# EAGLE design AVC-LAN-2 (EAGLE 6.1)
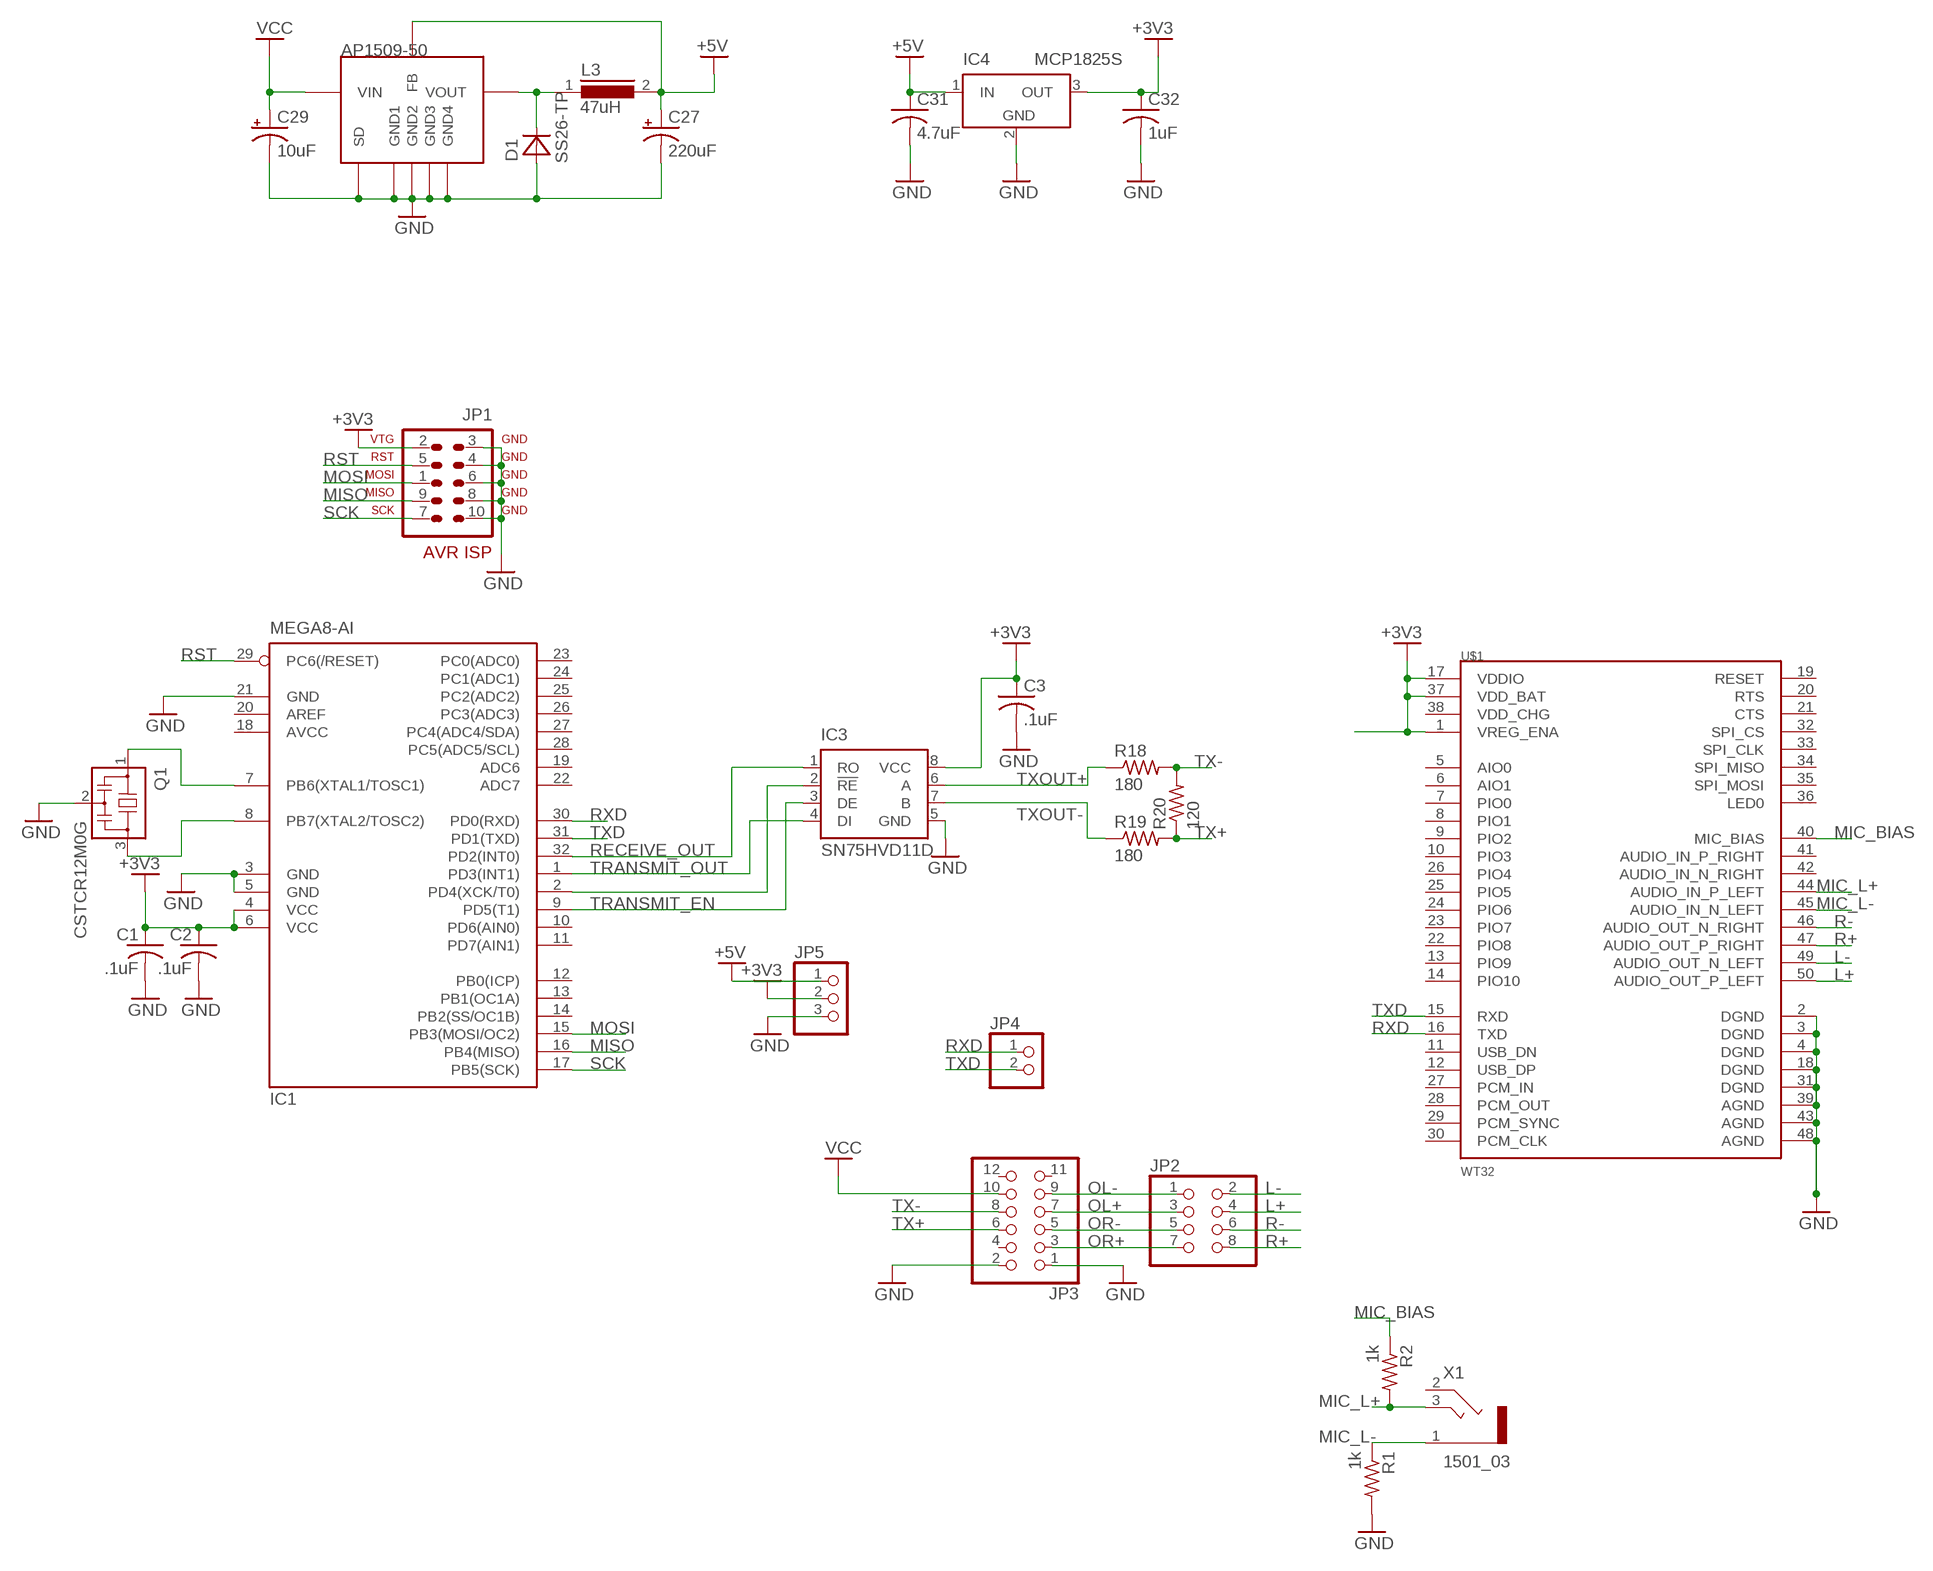
[diagram p0: schematic, sheet 1]

## Parts
C1  .1uF  C-USC0603  [C0603]
C2  .1uF  C-USC0603  [C0603]
C3  .1uF  C-USC0603  [C0603]
C27  220uF  CPOL-USD/7343-31W  [D/7343-31W]
C29  10uF  CPOL-USC/6032-28R  [C/6032-28R]
C31  4.7uF  C-USC0603  [C0603]
C32  1uF  C-USC0603  [C0603]
D1  SS26-TP  MBRA340T3  [SMA]
IC1  MEGA8-AI  [TQFP32-08]
IC3  SN75HVD11D  LTC485S  [SOIC8]
IC4  MCP1825S  LT1963EST-3.3  [SOT223]
JP1  AVR-ISP-10R  [AVR-ISP-10R]
JP2  PINHD-2X4  [2X04]
JP3  PINHD-2X6/90  [2X06/90]
JP4  PINHD-1X2  [1X02]
JP5  PINHD-1X3  [1X03]
L3  47uH  DR125  [DR125]
Q1  CSTCR12M0G  CSTCR6M00G53Z  [CSTER12M]
R1  1k  R-US_R0603  [R0603]
R2  1k  R-US_R0603  [R0603]
R18  180  R-US_R0603  [R0603]
R19  180  R-US_R0603  [R0603]
R20  120  R-US_R0603  [R0603]
U$1  WT32  [WT32]
U$5  AP1509-50  [SOP-8L]
X1  1501_03  [1501_03]

## Nets
+3V3: C1.1 C2.1 C3.1 C32.1 IC1.4(VCC) IC1.6(VCC) IC3.8(VCC) IC4.3(OUT) JP1.2 JP5.2 U$1.1(VREG_ENA) U$1.17(VDDIO) U$1.37(VDD_BAT)
+5V: C27.+ C31.1 IC4.1(IN) JP5.1 L3.2 U$5.P$3(FB)
GND: C1.2 C2.2 C3.2 C27.- C29.- C31.2 C32.2 D1.A IC1.3(GND) IC1.5(GND) IC1.21(GND) IC3.5(GND) IC4.2(GND) JP1.3 JP1.4 JP1.6 JP1.8 JP1.10 JP3.1 JP3.2 JP5.3 Q1.2 R1.2 U$1.2(DGND) U$1.3(DGND) U$1.4(DGND) U$1.18(DGND) U$1.31(DGND) U$1.39(AGND) U$1.43(AGND) U$1.48(AGND) U$5.P$4(SD) U$5.P$5(GND1) U$5.P$6(GND2) U$5.P$7(GND3) U$5.P$8(GND4)
L+: JP2.4 U$1.50(AUDIO_OUT_P_LEFT)
L-: JP2.2 U$1.49(AUDIO_OUT_N_LEFT)
MIC_BIAS: R2.1 U$1.40(MIC_BIAS)
MIC_L+: R2.2 U$1.44(AUDIO_IN_P_LEFT) X1.3
MIC_L-: R1.1 U$1.45(AUDIO_IN_N_LEFT) X1.1
MISO: IC1.16(PB4(MISO)) JP1.9
MOSI: IC1.15(PB3(MOSI/OC2)) JP1.1
N$1: IC1.2(PD4(XCK/T0)) IC3.2(!RE)
N$23: IC1.7(PB6(XTAL1/TOSC1)) Q1.1
N$24: IC1.8(PB7(XTAL2/TOSC2)) Q1.3
OL+: JP2.3 JP3.7
OL-: JP2.1 JP3.9
OR+: JP2.7 JP3.3
OR-: JP2.5 JP3.5
R+: JP2.8 U$1.47(AUDIO_OUT_P_RIGHT)
R-: JP2.6 U$1.46(AUDIO_OUT_N_RIGHT)
RECEIVE_OUT: IC1.32(PD2(INT0)) IC3.1(RO)
RST: IC1.29(PC6(/RESET)) JP1.5
RXD: IC1.30(PD0(RXD)) JP4.1 U$1.16(TXD)
SCK: IC1.17(PB5(SCK)) JP1.7
TRANSMIT_EN: IC1.9(PD5(T1)) IC3.3(DE)
TRANSMIT_OUT: IC1.1(PD3(INT1)) IC3.4(DI)
TX+: JP3.6 R19.2 R20.1
TX-: JP3.8 R18.2 R20.2
TXD: IC1.31(PD1(TXD)) JP4.2 U$1.15(RXD)
TXOUT+: IC3.6(A) R18.1
TXOUT-: IC3.7(B) R19.1
VCC: C29.+ JP3.10 U$5.P$1(VIN)
VOUT: D1.C L3.1 U$5.P$2(VOUT)
Unconnected: IC1.10(PD6(AIN0)) IC1.11(PD7(AIN1)) IC1.12(PB0(ICP)) IC1.13(PB1(OC1A)) IC1.14(PB2(SS/OC1B)) IC1.19(ADC6) IC1.20(AREF) IC1.22(ADC7) IC1.23(PC0(ADC0)) IC1.24(PC1(ADC1)) IC1.25(PC2(ADC2)) IC1.26(PC3(ADC3)) IC1.27(PC4(ADC4/SDA)) IC1.28(PC5(ADC5/SCL)) JP3.4 JP3.11 JP3.12 U$1.5(AIO0) U$1.6(AIO1) U$1.7(PIO0) U$1.8(PIO1) U$1.9(PIO2) U$1.10(PIO3) U$1.11(USB_DN) U$1.12(USB_DP) U$1.13(PIO9) U$1.14(PIO10) U$1.19(RESET) U$1.20(RTS) U$1.21(CTS) U$1.22(PIO8) U$1.23(PIO7) U$1.24(PIO6) U$1.25(PIO5) U$1.26(PIO4) U$1.27(PCM_IN) U$1.28(PCM_OUT) U$1.29(PCM_SYNC) U$1.30(PCM_CLK) U$1.32(SPI_CS) U$1.33(SPI_CLK) U$1.34(SPI_MISO) U$1.35(SPI_MOSI) U$1.36(LED0) U$1.38(VDD_CHG) U$1.41(AUDIO_IN_P_RIGHT) U$1.42(AUDIO_IN_N_RIGHT) X1.2

## Power pins joined to a net without a drawn wire
AVCC: IC1.18(AVCC)
GND: IC4.4(GND)

## Library data of the parts
C1-C3 C31 C32 = rcl-2:C-US: CAPACITOR, American symbol
C27 C29 = rcl:CPOL-US: POLARIZED CAPACITOR, American symbol
D1 = diode:MBRA340T3: Surface Mount Schottky Power Rectifier Source: http://www.onsemi.com/pub_link/Collateral/MBRA340T3-D.PDF
IC1 = atmel:MEGA8: MICROCONTROLLER 8 Kbytes FLASH, 1 kbytes SRAM, 512 bytes EEPROM, USART, 6-channel 10 bit ADC, 2-channel 8 bit ADC Pin compatible with Atmega48, ATMega88, ATMega168 Source: avr.lbr; MPN: ATMEGA8-16AU; OC_FARNELL: 9171371; OC_NEWARK: 73M8863
IC3 = linear-technology:LTC485: Low Power RS485 Interface Transceiver Source: http://www.linear.com/pc/downloadDocument.do?navId=H0,C1,C1007,C1017,P2064,D1718; OC_FARNELL: unknown; OC_NEWARK: unknown
IC4 = linear-technology:LT1963EST: 1.5A, Low Noise, Fast Transient Response LDO Regulator Source: http://www.linear.com/pc/downloadDocument.do?navId=H0,C3,P2222,D3148; MPN: LT1963EST-3.3; OC_FARNELL: 1501032; OC_NEWARK: 57M7546
JP1 = avr-7:AVR-ISP-10: AVR ISP-10 Serial Programming Header
JP2 = pinhead:PINHD-2X4: PIN HEADER
JP3 = pinhead:PINHD-2X6: PIN HEADER
JP4 = pinhead:PINHD-1X2: PIN HEADER
JP5 = pinhead:PINHD-1X3: PIN HEADER
L3 = inductors:DR125: High Power Density, High Efficiency, Shielded Inductors Source: coiltronics_dr_series.pdf
Q1 = cstce-resonator:CSTCR: Resonator Source: murata.co.jp; MPN: CSTCC12M0; OC_FARNELL: 1170434; OC_NEWARK: 25M8759
R1 R2 R18-R20 = rcl-2:R-US_: RESISTOR, American symbol
U$1 = SparkFun:WT32: Blue Giga Audio Bluetooth Module Footprint is not confirmed yet.
U$5 = buckReg:AP1509-50
X1 = con-lumberg-mod:1501_03: Klinkensteckverbinder nach JISC 6560, 3,5 mm Jack connectors according to JISC 6560, 2.5 mm Source: http://www.lumberg.com/Produkte/PDFs/1501_03.pdf; OC_FARNELL: 1200127; OC_NEWARK: unknown

## Board
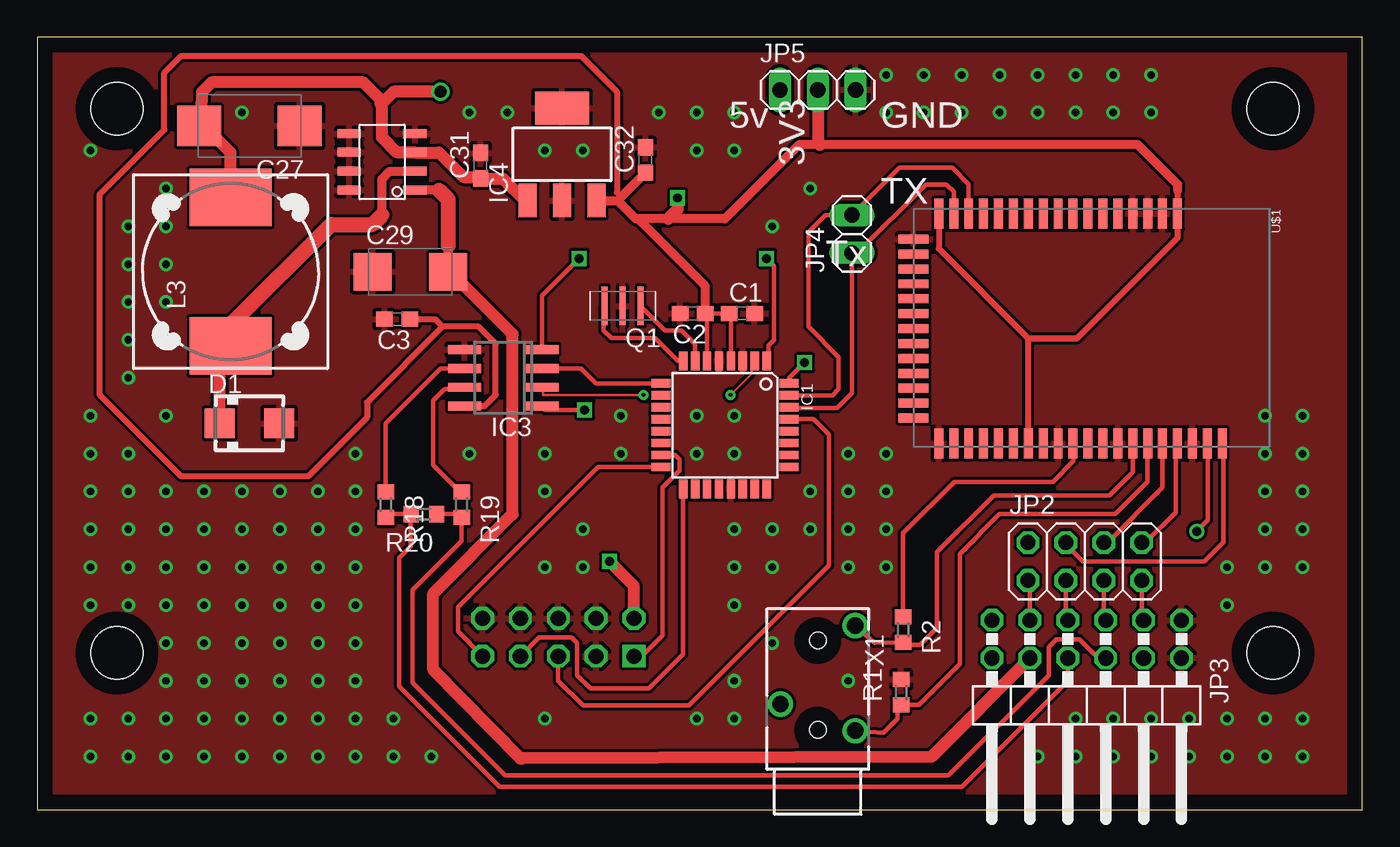
[diagram p1: board, top side]
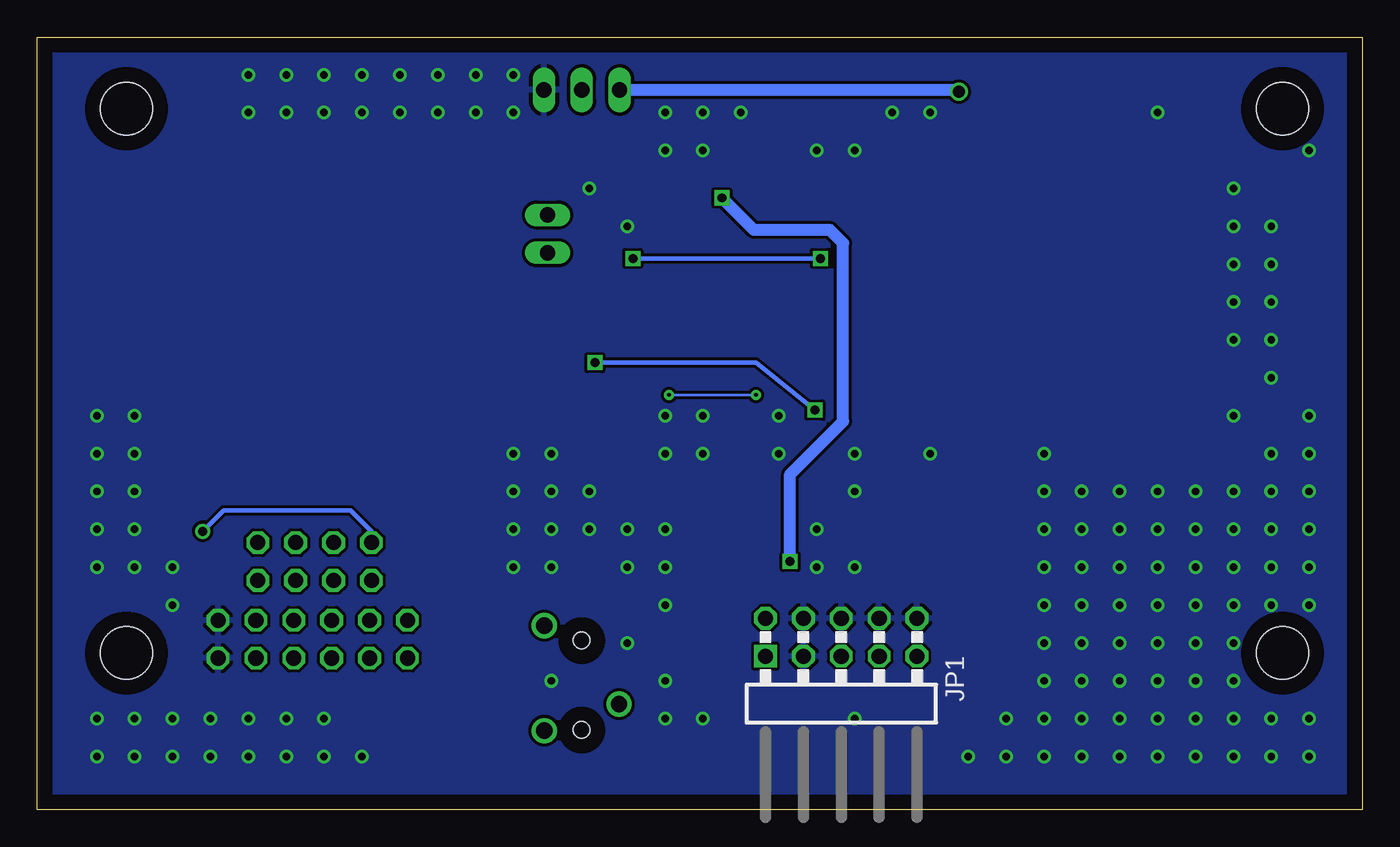
[diagram p2: board, bottom side, seen from below]

Size 88.82 x 51.79 mm. Coordinates in mm from the lower left corner, seen from the top.
Outline: 0,0 88.82,0 88.82,51.79 0,51.79 0,0
Copper layers (1*16): Top 0.035mm / dielectric 1.5mm / Bottom 0.035mm
Design rules: minimum track width 7mil, minimum drill 10mil, track to track 8mil, track to pad 8mil, pad to pad 7mil, via to via 8mil, smd to smd 7mil, copper to edge 40mil, drill to drill 8mil, minimum pad ring 10mil, minimum via ring 8mil, stop-mask expansion 4mil, vias tented up to drill 0mil, thermal gap 10mil
Holes 3.51 mm at 5.35,10.5 82.84,10.5 82.84,47 5.35,47

### Footprints (pad centres in the part's own frame; a part is rotated, then mirrored left to right if it is on the bottom)
C0603 = smd 1.1 x 1: 1 -0.85,0; 2 0.85,0
D/7343-31W = smd 2.95 x 2.7: + 3.375,0; - -3.375,0
C/6032-28R = smd 2.55 x 2.5: + 2.525,0; - -2.525,0
SMA = smd 2 x 2: A 2,0; C -2,0
TQFP32-08 = smd 1.27 x 0.559: 1 -4.293,2.8; 2 -4.293,2; 3 -4.293,1.2; 4 -4.293,0.4; 5 -4.293,-0.4; 6 -4.293,-1.2; 7 -4.293,-2; 8 -4.293,-2.8; 17 4.293,-2.8; 18 4.293,-2; 19 4.293,-1.2; 20 4.293,-0.4; 21 4.293,0.4; 22 4.293,1.2; 23 4.293,2; 24 4.293,2.8 | smd 0.559 x 1.27: 9 -2.8,-4.293; 10 -2,-4.293; 11 -1.2,-4.293; 12 -0.4,-4.293; 13 0.4,-4.293; 14 1.2,-4.293; 15 2,-4.293; 16 2.8,-4.293; 25 2.8,4.293; 26 2,4.293; 27 1.2,4.293; 28 0.4,4.293; 29 -0.4,4.293; 30 -1.2,4.293; 31 -2,4.293; 32 -2.8,4.293
SOIC8 = smd 0.6 x 2.2: 1 -1.905,-2.6; 2 -0.635,-2.6; 3 0.635,-2.6; 4 1.905,-2.6; 5 1.905,2.6; 6 0.635,2.6; 7 -0.635,2.6; 8 -1.905,2.6
SOT223 = smd 1.219 x 2.235: 1 -2.311,-3.099; 2 0,-3.099; 3 2.311,-3.099 | smd 3.6 x 2.2: 4 0,3.099
AVR-ISP-10R = drill 1.016 square: 1 -5.08,-1.27 | drill 1.016 octagon: 2 -5.08,1.27; 3 -2.54,-1.27; 4 -2.54,1.27; 5 0,-1.27; 6 0,1.27; 7 2.54,-1.27; 8 2.54,1.27; 10 5.08,1.27 | drill 1.016 pad 1.422 octagon: 9 5.08,-1.27
2X04 = drill 1.016 octagon: 1 -3.81,-1.27; 2 -3.81,1.27; 3 -1.27,-1.27; 4 -1.27,1.27; 5 1.27,-1.27; 6 1.27,1.27; 7 3.81,-1.27; 8 3.81,1.27
2X06/90 = drill 1.016 octagon: 1 -6.35,-6.35; 2 -6.35,-3.81; 3 -3.81,-6.35; 4 -3.81,-3.81; 5 -1.27,-6.35; 6 -1.27,-3.81; 7 1.27,-6.35; 8 1.27,-3.81; 9 3.81,-6.35; 10 3.81,-3.81; 11 6.35,-6.35; 12 6.35,-3.81
1X02 = drill 1.016 long: 1 -1.27,0; 2 1.27,0
1X03 = drill 1.016 long: 1 -2.54,0; 2 0,0; 3 2.54,0
DR125 = smd 3.85 x 5.5: 1 -4.975,0; 2 4.975,0
CSTER12M = smd 0.4 x 2.6: 1 -1.2,0; 2 0,0; 3 1.2,0
R0603 = smd 1 x 1.1: 1 -0.85,0; 2 0.85,0
WT32 = smd 2 x 0.6: 1 -7.7,5.7; 2 -7.7,4.7; 3 -7.7,3.7; 4 -7.7,2.7; 5 -7.7,1.7; 6 -7.7,0.7; 7 -7.7,-0.3; 8 -7.7,-1.3; 9 -7.7,-2.3; 10 -7.7,-3.3; 11 -7.7,-4.3; 12 -7.7,-5.3; 13 -7.7,-6.3; 14 -7.7,-7.3; 15 -7.7,-8.3; 16 -7.7,-9.3; 17 -7.7,-10.3; 31 7.7,-10.3; 32 7.7,-9.3; 33 7.7,-8.3; 34 7.7,-7.3; 35 7.7,-6.3; 36 7.7,-5.3; 37 7.7,-4.3; 38 7.7,-3.3; 39 7.7,-2.3; 40 7.7,-1.3; 41 7.7,-0.3; 42 7.7,0.7; 43 7.7,1.7; 44 7.7,2.7; 45 7.7,3.7; 46 7.7,4.7; 47 7.7,5.7; 48 7.7,6.7; 49 7.7,7.7; 50 7.7,8.7 | smd 0.6 x 2: 18 -6,-12; 19 -5,-12; 20 -4,-12; 21 -3,-12; 22 -2,-12; 23 -1,-12; 24 0,-12; 25 1,-12; 26 2,-12; 27 3,-12; 28 4,-12; 29 5,-12; 30 6,-12
SOP-8L = smd 0.6 x 1.55: P$1 -1.905,-2.2; P$2 -0.635,-2.2; P$3 0.635,-2.2; P$4 1.905,-2.2; P$5 1.905,2.2; P$6 0.655,2.2; P$7 -0.635,2.2; P$8 -1.905,2.2
1501_03 = drill 1.1 pad 1.7: 1 -2.5,0.3; 2 2.5,-1.5; 3 -2.5,-6.75 | hole 1.1: 0,0.25; 0,-5.75

### Placement (x,y rotation side)
C1  47.24,33.27 0 top
C2  43.94,33.27 180 top
C3  24.13,32.89 180 top
C27  14.22,45.85 180 top
C29  25.02,36.07 0 top
C31  29.72,43.18 90 top
C32  40.77,43.56 90 top
D1  14.22,25.91 0 top
IC1  46.1,25.78 270 top
IC3  31.24,28.96 90 top
IC4  35.18,43.94 0 top
JP1  34.92,11.56 0 bottom
JP2  70.23,16.64 0 top
JP3  70.36,6.35 180 top
JP4  54.61,38.61 90 top
JP5  52.32,48.26 0 top
L3  12.95,36.07 90 top
Q1  39.24,33.78 180 top
R1  57.91,7.87 90 top
R2  58.04,12.06 270 top
R18  23.37,20.45 270 top
R19  28.45,20.45 270 top
R20  25.91,19.81 180 top
U$1  70.74,32.26 270 top
U$5  23.11,43.43 90 top
X1  52.32,5.59 180 top

### Tracks (layer width: path | path; a pad name or v marks a point on that pad's centre or on a via)
+3V3  (via drill 0.6)
  Top 0.305: IC1.4 46.5,33.17 C1.1 C2.1 44.9,33.16 IC1.6
  Top 0.406: U$1.17 60.44,37.6 66.42,31.62 | 66.42,31.62 66.44,31.61 | U$1.37 66.44,31.61 | 66.44,31.61 69.7,31.61 69.72,31.62 | 76.45,39.94 76.45,38.35 69.72,31.62 | 76.45,39.94 U$1.1 | 66.42,31.62 69.72,31.62 | 76.45,39.94 76.45,41.53 | IC3.8 29.97,27.05 30.73,27.81 30.73,31.24 29.59,32.38 27.18,32.38 | 27.18,32.38 22.1,27.3 22.1,26.29 18.16,22.35 9.65,22.35 4.19,27.81 4.19,41.27 8.51,45.59 8.51,49.4 9.65,50.55 36.45,50.55 38.86,48.13 38.86,41.4 39.16,41.1 | C3.1 26.67,32.89 27.18,32.38
  Top 0.61: IC4.3 38.9,40.84 | 38.9,40.84 39.16,41.1 C32.1 | 76.45,41.53 76.45,41.91 73.79,44.58 52.45,44.58 51.05,44.58 46.1,39.62 42.29,39.62 40.26,39.62 | 40.26,39.62 40.12,39.62 38.9,40.84 | C2.1 44.79,35.09 40.26,39.62
  Top 0.813: JP1.2 40,14.99 v38.35,16.64 | v42.93,41.02 42.93,40.26 42.29,39.62 | JP5.2 52.32,44.7 52.45,44.58
  Bottom 0.813: v38.35,16.64 38.35,22.48 34.8,26.04 34.8,37.97 35.69,38.86 40.77,38.86 v42.93,41.02
+5V  (via drill 0.8)
  Top 0.178: 11.3,45.72 11.18,45.59 C27.+
  Top 0.813: L3.2 12.95,44.07 11.3,45.72 10.79,46.23 | IC4.1 32.69,40.84 31.24,42.29 29.76,42.29 C31.1 29.63,42.42 28.57,42.42 26.92,44.07 U$5.P$3 24.13,44.07 23.11,45.09 23.11,47.37 | 23.11,47.37 23.11,47.5 | 23.11,47.5 21.84,48.77 11.68,48.77 11.05,48.13 10.92,46.3 C27.+ | v27.05,48.13 23.88,48.13 23.11,47.37 | 23.11,47.37 22.99,47.37 23.11,47.5
  Bottom 0.813: JP5.1 27.18,48.26 v27.05,48.13
GND  (via drill 0.5)
  other vias: 3.56,3.56 6.1,3.56 8.64,3.56 11.18,3.56 13.72,3.56 16.26,3.56 18.8,3.56 21.34,3.56 23.88,3.56 26.42,3.56 23.88,6.1 21.34,6.1 18.8,6.1 16.26,6.1 13.72,6.1 11.18,6.1 8.64,6.1 3.56,6.1 6.1,6.1 8.64,8.64 11.18,8.64 13.72,8.64 16.26,8.64 18.8,8.64 21.34,8.64 21.34,11.18 21.34,13.72 18.8,13.72 18.8,11.18 16.26,11.18 13.72,11.18 11.18,11.18 8.64,11.18 8.64,13.72 8.64,16.26 6.1,16.26 6.1,13.72 3.56,13.72 3.56,16.26 11.18,16.26 11.18,13.72 13.72,13.72 13.72,18.8 13.72,16.26 16.26,16.26 16.26,13.72 18.8,16.26 21.34,16.26 21.34,18.8 21.34,21.34 21.34,23.88 18.8,21.34 18.8,18.8 16.26,21.34 16.26,18.8 11.18,18.8 8.64,18.8 6.1,18.8 3.56,18.8 3.56,21.34 6.1,21.34 8.64,21.34 11.18,21.34 13.72,21.34 3.56,23.88 3.56,26.42 6.1,23.88 8.64,26.42 28.96,23.88 34.04,23.88 34.04,21.34 34.04,16.26 36.58,18.8 36.58,16.26 39.12,23.88 39.12,26.42 44.2,26.42 44.2,23.88 46.74,23.88 46.74,26.42 49.28,18.8 51.82,18.8 51.82,21.34 46.74,18.8 46.74,16.26 46.74,13.72 49.28,16.26 54.36,18.8 54.36,21.34 54.36,23.88 56.9,16.26 56.9,23.88 56.9,21.34 56.9,18.8 54.36,16.26 46.74,8.64 49.28,11.18 44.2,6.1 46.74,6.1 34.04,6.1 54.36,8.64 69.6,6.1 67.06,3.56 69.6,3.56 72.14,3.56 72.14,6.1 74.68,6.1 77.22,6.1 74.68,3.56 77.22,3.56 79.76,3.56 82.3,3.56 84.84,3.56 79.76,6.1 82.3,6.1 84.84,6.1 79.76,16.26 79.76,13.72 82.3,16.26 84.84,16.26 84.84,18.8 84.84,23.88 84.84,21.34 82.3,21.34 82.3,18.8 82.3,23.88 82.3,26.42 84.84,26.42 6.1,28.96 8.64,31.5 6.1,34.04 8.64,36.58 6.1,31.5 8.64,34.04 6.1,36.58 6.1,39.12 8.64,41.66 8.64,39.12 3.56,44.2 13.72,46.74 28.96,46.74 31.5,46.74 34.04,44.2 36.58,44.2 41.66,46.74 44.2,46.74 46.74,46.74 46.74,44.2 44.2,44.2 49.28,39.12 51.82,41.66 56.9,46.74 56.9,49.28 59.44,49.28 61.98,49.28 64.52,49.28 67.06,49.28 69.6,49.28 72.14,49.28 74.68,49.28 74.68,46.74 72.14,46.74 69.6,46.74 67.06,46.74 64.52,46.74 61.98,46.74 59.44,46.74
  pour Bottom: 0.64,0.64 0.64,51.44 88.27,51.44 88.27,0.64
  pour Top: 0.64,0.64 0.64,51.44 88.27,51.44 88.27,0.64
L+
  Top 0.305: JP2.4 68.96,17.78 70.1,16.64 78.23,16.64 79.5,17.91 79.5,24.5 U$1.50
L-  (via drill 0.6)
  Top 0.305: v77.72,18.67 78.49,19.43 78.49,24.51 U$1.49
  Bottom 0.305: JP2.2 66.42,18.67 67.82,20.07 76.33,20.07 v77.72,18.67
MIC_BIAS
  Top 0.305: R2.1 58.04,18.54 61.47,21.97 68.07,21.97 69.47,23.37 69.47,24.02 U$1.40
MIC_L+
  Top 0.305: X1.3 56.11,11.2 R2.2 58.08,11.05 59.18,11.05 60.32,12.19 60.32,17.27 64.14,21.08 71.88,21.08 73.44,22.64 U$1.44
MIC_L-
  Top 0.305: X1.1 56.72,5.16 57.66,6.1 57.66,6.6 58.04,6.99 | 57.91,6.99 58.04,6.99 | R1.1 58,7.02 | 58,7.02 58.04,6.99 | 58,7.02 59.09,7.02 61.85,9.78 61.85,17.14 64.52,19.81 72.26,19.81 74.42,21.97 74.42,24.67 U$1.45
MISO
  Top 0.305: IC1.16 37.59,22.98 28.19,13.59 28.19,11.94 JP1.9
MOSI
  Top 0.305: JP1.1 40.51,10.29 41.91,11.68 41.91,21.59 43.05,22.73 43.05,23.5 42.77,23.78 IC1.15
N$1  (via drill 0.25)
  Top 0.178: v46.48,27.81 47.88,29.21 47.88,29.84 48.01,29.97 IC1.2 | v40.64,27.81 33.91,27.81 33.91,28.32 IC3.2
  Bottom 0.178: v40.64,27.81 v46.48,27.81
N$23
  Top 0.305: IC1.7 44.1,31.21 43.18,32.13 42.09,32.13 Q1.1
N$24
  Top 0.305: IC1.8 42.95,30.07 41.4,31.62 38.48,31.62 37.97,32.13 37.97,33.71 Q1.3
OL+
  Top 0.305: JP2.3 68.96,12.83 JP3.7
OL-
  Top 0.305: JP3.9 66.55,15.49 66.42,15.49 JP2.1
OR+
  Top 0.305: JP2.7 74.04,12.83 JP3.3
OR-
  Top 0.305: JP2.5 71.5,12.83 JP3.5
R+
  Top 0.305: JP2.8 74.3,17.91 76.33,19.94 76.33,24.45 U$1.47
R-
  Top 0.305: JP2.6 71.75,17.91 75.44,21.59 U$1.46
RECEIVE_OUT  (via drill 0.6)
  Top 0.178: IC3.1 33.91,27.05 33.85,26.99
  Top 0.305: IC1.32 50.39,28.93 v51.44,29.97 | v36.7,26.8 34.04,26.8 33.85,26.99 33.78,27.05
  Bottom 0.305: v51.44,29.97 40.64,29.97 v36.7,26.8
RST
  Top 0.305: IC1.29 52.05,26.18 53.09,25.15 53.09,16.38 43.69,6.99 36.58,6.99 34.92,8.64 JP1.5
RXD
  Top 0.305: U$1.16 61.44,41.43 60.96,41.91 59.56,41.91 54.99,37.34 JP4.1 54.61,27.94 53.59,26.92 50.45,26.92 IC1.30
SCK
  Top 0.305: IC1.17 43.3,10.41 41.02,8.13 37.08,8.13 36.2,9.02 36.2,11.18 35.81,11.56 33.66,11.56 JP1.7
TRANSMIT_EN
  Top 0.305: IC1.9 37.46,28.58 36.45,29.59 IC3.3
TRANSMIT_OUT  (via drill 0.6)
  Top 0.178: IC1.1 48.89,30.1 49.02,30.1
  Top 0.305: IC3.4 33.84,34.48 v36.32,36.96 | v48.89,36.96 49.4,36.45 49.4,31.5 49.02,31.11 49.02,30.1 48.89,29.97
  Bottom 0.305: v36.32,36.96 v48.89,36.96
TX+
  Top 0.305: R20.1 28.23,19.81 R19.2 28.45,18.03 25.15,14.73 25.15,8.51 31.37,2.29 61.09,2.29 67.82,9.02 67.82,10.92 68.33,11.43 69.85,11.43 70.87,10.41 71.5,10.41 71.75,10.16 JP3.6
TX-
  Top 0.305: R20.2 25.02,19.81 | 25.02,19.81 23.58,19.81 R18.2 | JP3.8 69.09,8.64 61.98,1.52 30.99,1.52 24.26,8.26 24.26,16.89 25.02,17.65 25.02,19.81
TXD
  Top 0.305: U$1.15 62.44,41.95 61.34,43.05 57.78,43.05 JP4.2 52.83,39.88 51.69,38.73 51.69,32.38 53.72,30.35 53.72,28.19 53.31,27.78 IC1.31
TXOUT+
  Top 0.305: R18.1 23.37,25.91 27.05,29.59 IC3.6
TXOUT-
  Top 0.305: R19.1 28.36,21.3 26.54,23.11 26.54,27.43 27.3,28.19 28.52,28.19 IC3.7
VCC
  Top 0.178: C29.+ 27.56,36.07 27.62,36.13
  Top 0.61: C29.+ 27.54,37.83 27.56,37.85 | 26.92,41.53 U$5.P$1
  Top 0.813: JP3.10 59.94,3.56 32.51,3.43 32.38,3.43 26.54,9.4 26.54,14.48 31.88,19.81 31.88,31.88 27.62,36.13 27.56,36.2 27.56,36.07
  Top 1.016: 27.56,37.85 27.56,40.89 26.92,41.53
VOUT
  Top 0.61: 23.11,39.88 23.11,42.29 23.62,42.8 U$5.P$2 25.4,42.8
  Top 0.813: D1.C 12.22,30.39 12.83,30.99 | 12.83,30.99 12.95,31.11 12.95,30.99 12.83,30.99
  Top 1.016: L3.1 12.95,31.11 12.95,32.51 19.68,39.24 22.48,39.24 23.11,39.88

### Text on the board
tPlace: 5v | GND | 3V3 | TX | Tx